# EAGLE schematic Gamma-TOP-Version2 (EAGLE 9.5.2)
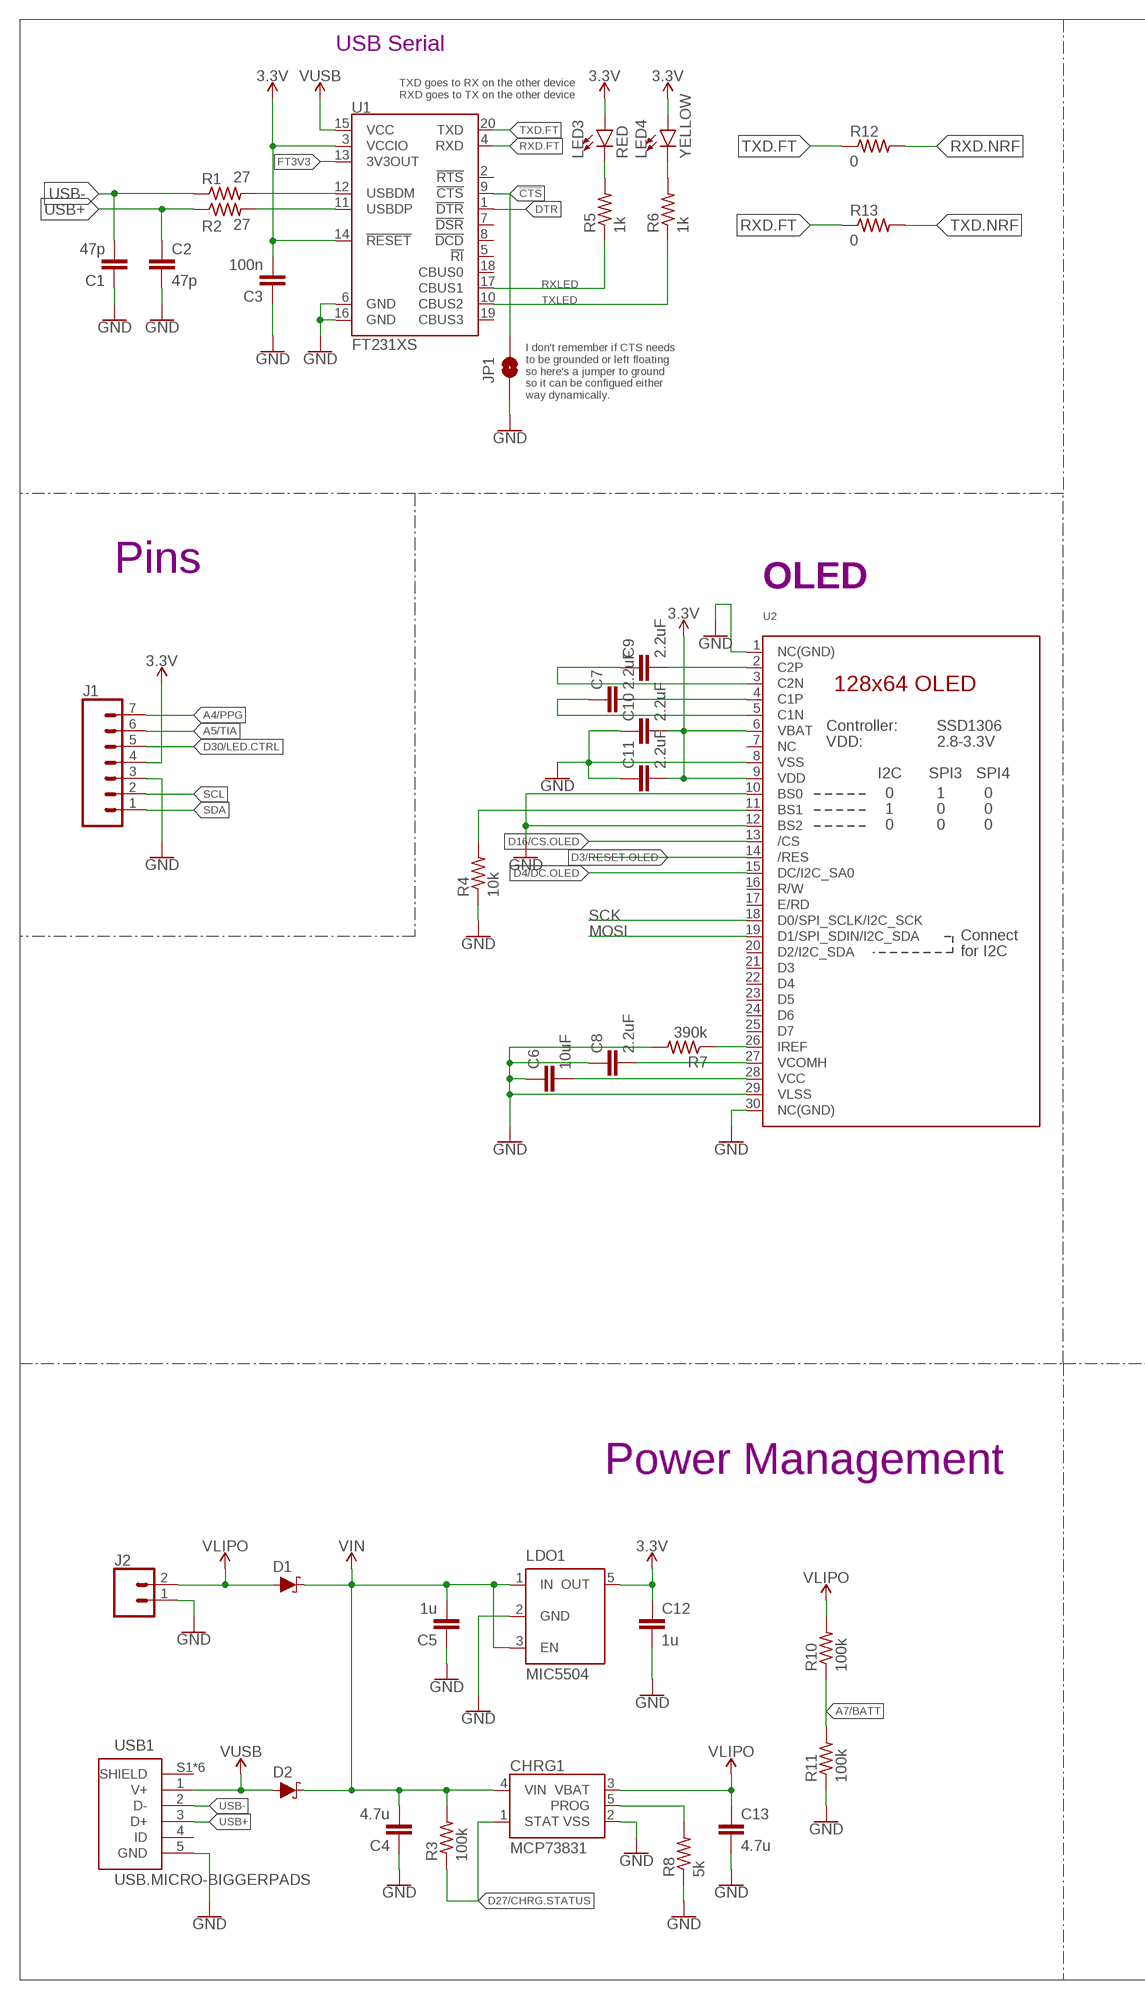
[diagram p0: schematic, sheet 1, part 1 of 2]
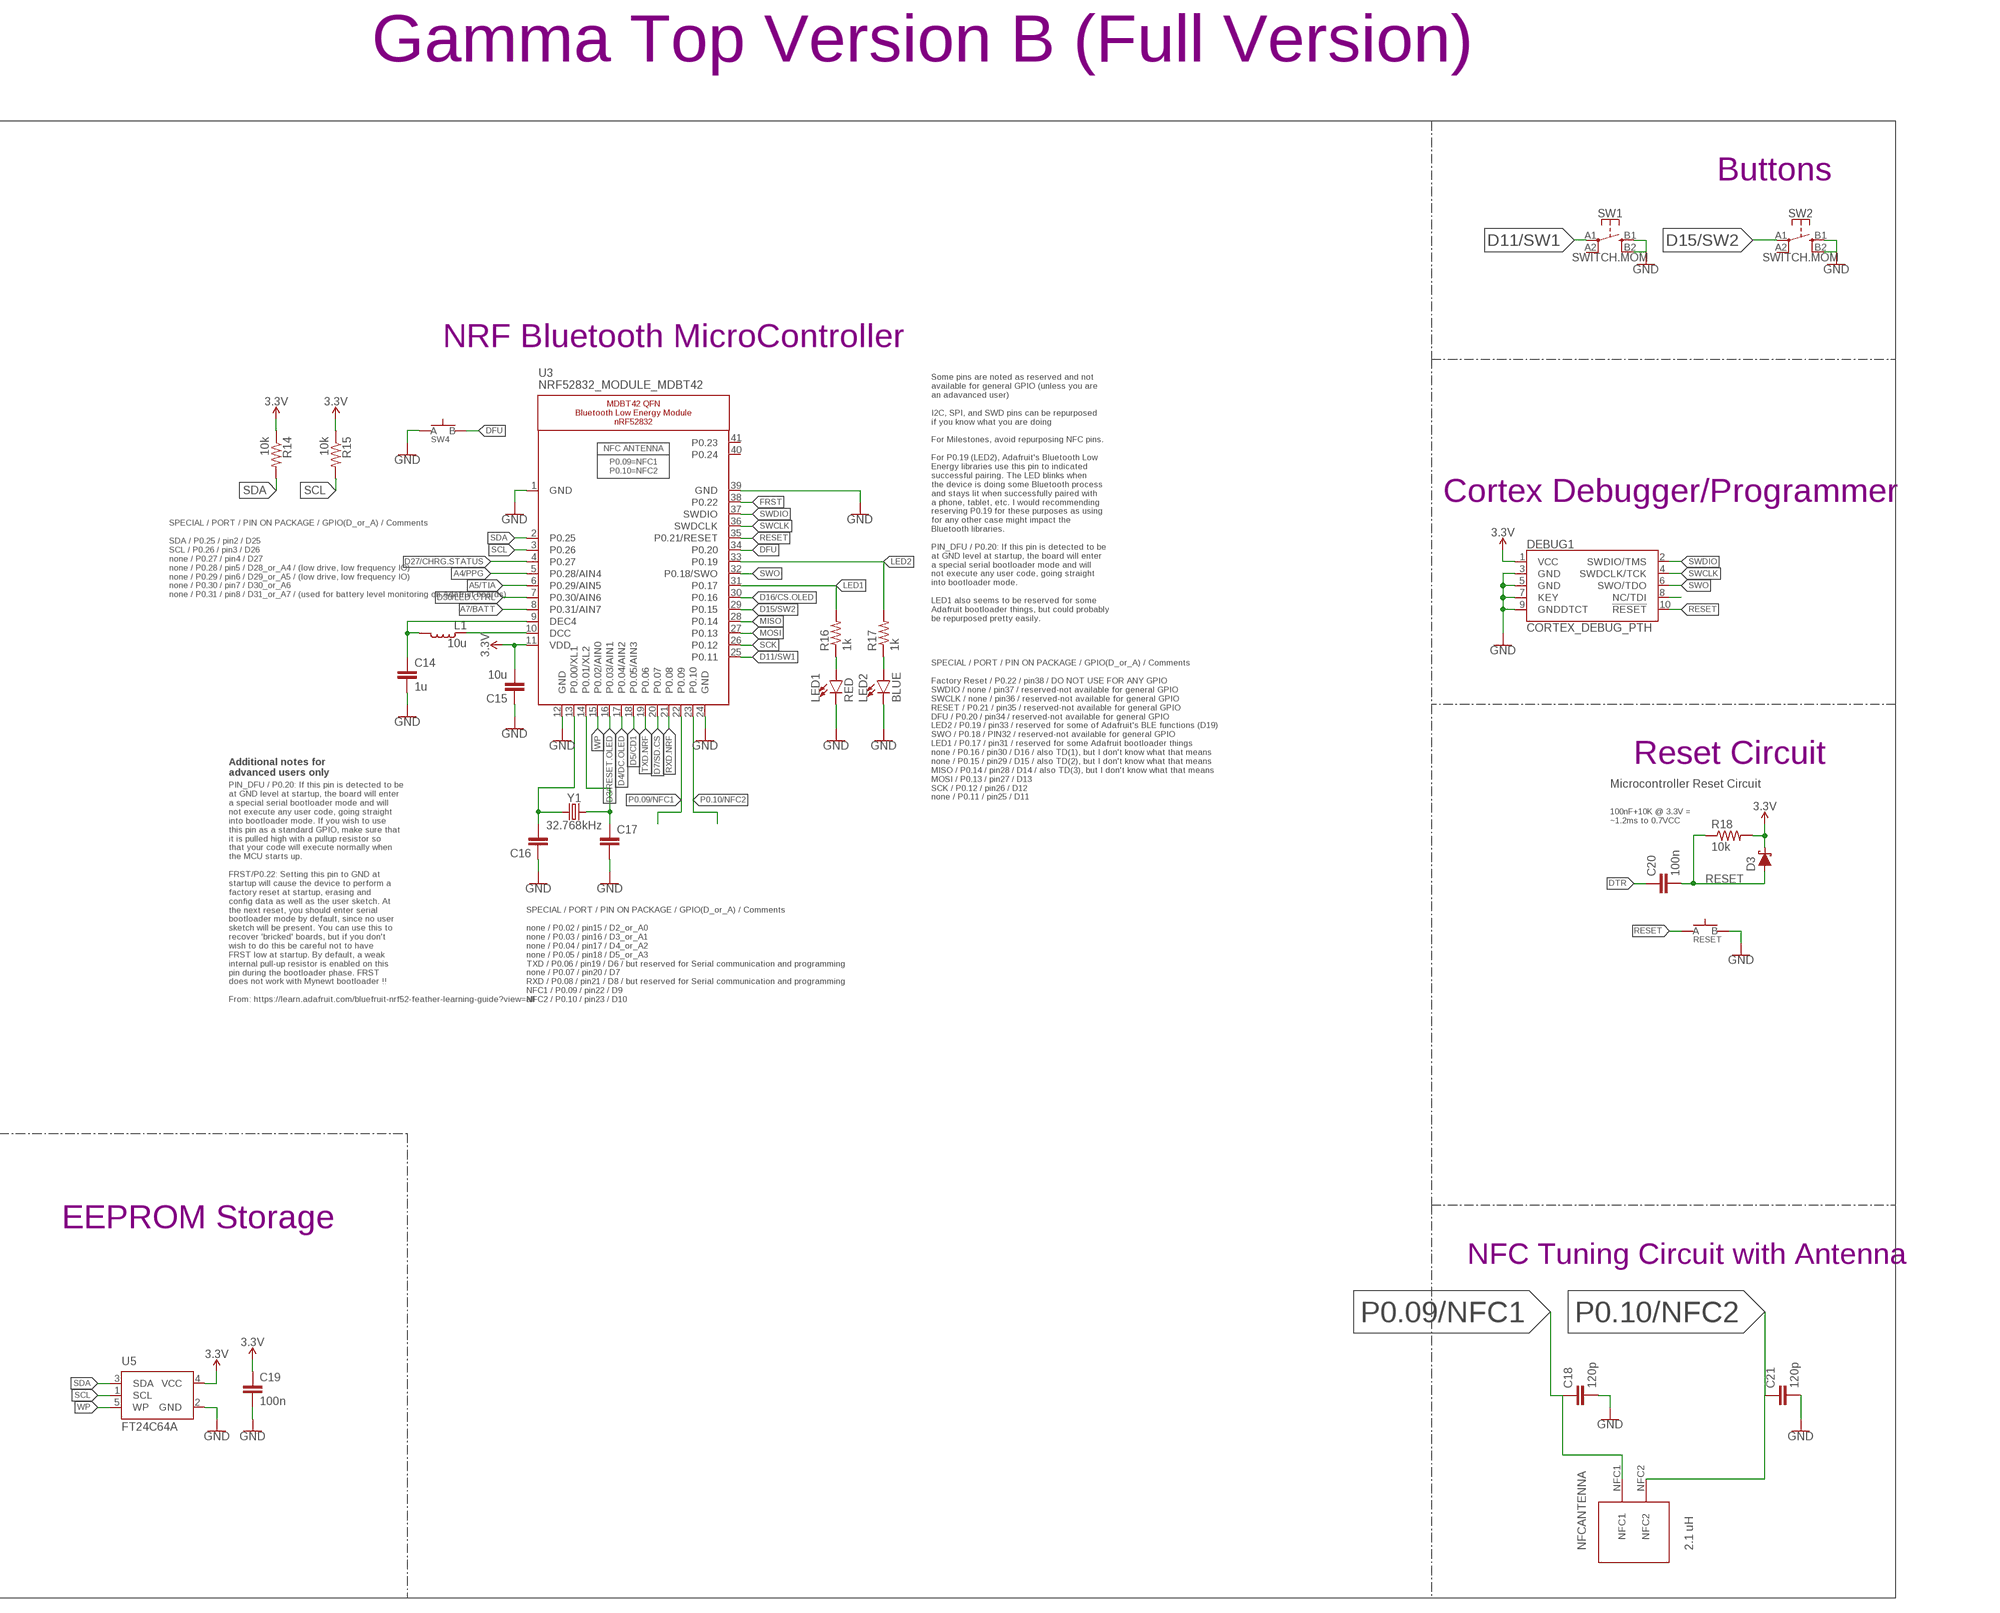
[diagram p1: schematic, sheet 1, part 2 of 2]

## Parts
C1  47p  CAPACITOR0603  [C0603]
C2  47p  CAPACITOR0603  [C0603]
C3  100n  CAPACITOR0603  [C0603]
C4  4.7u  CAPACITOR0603  [C0603]
C5  1u  CAPACITOR0603  [C0603]
C6  10uF  CAPACITOR0603  [C0603]
C7  2.2uF  CAPACITOR0402  [C0402]
C8  2.2uF  CAPACITOR0603  [C0603]
C9  2.2uF  CAPACITOR0402  [C0402]
C10  2.2uF  CAPACITOR0402  [C0402]
C11  2.2uF  CAPACITOR0402  [C0402]
C12  1u  CAPACITOR0603  [C0603]
C13  4.7u  CAPACITOR0603  [C0603]
C14  1u  CAPACITOR0603  [C0603]
C15  10u  CAPACITOR0805  [C0805]
C16  CAPACITOR0603  [C0603]
C17  CAPACITOR0603  [C0603]
C18  120p  CAPACITOR0603  [C0603]
C19  100n  CAPACITOR0603  [C0603]
C20  100n  CAPACITOR0603  [C0603]
C21  120p  CAPACITOR0603  [C0603]
CHRG1  MCP73831  [SOT23-5]
D1  SCHOTTKY-USC  [USC]
D2  SCHOTTKY-USC  [USC]
D3  SCHOTTKY-USC  [USC]
DEBUG1  CORTEX_DEBUG_PTH  [2X5-PTH-1.27MM]
J1  CONN_07-1.27MM  [1X07_1.27MM]
J2  CONN_02  [1X02]
JP1  JUMPER-SMT_2_NO_SILK  [SMT-JUMPER_2_NO_SILK]
L1  10u  INDUCTOR0603  [L0603]
LDO1  MIC5504  [SOT23-5]
LED1  RED  LED0603  [LED-0603]
LED2  BLUE  LED0603  [LED-0603]
LED3  RED  LED0603  [LED-0603]
LED4  YELLOW  LED0603  [LED-0603]
NFCANTENNA  2.1 uH  MOLEX-1462360151-ANTENNA  [1462360151]
R1  27  RESISTOR0603  [R0603]
R2  27  RESISTOR0603  [R0603]
R3  100k  RESISTOR0603  [R0603]
R4  10k  RESISTOR0603  [R0603]
R5  1k  RESISTOR0603  [R0603]
R6  1k  RESISTOR0603  [R0603]
R7  390k  RESISTOR0603  [R0603]
R8  5k  RESISTOR0603  [R0603]
R10  100k  RESISTOR0603  [R0603]
R11  100k  RESISTOR0603  [R0603]
R12  0  RESISTOR0603  [R0603]
R13  0  RESISTOR0603  [R0603]
R14  10k  RESISTOR0603  [R0603]
R15  10k  RESISTOR0603  [R0603]
R16  1k  RESISTOR0603  [R0603]
R17  1k  RESISTOR0603  [R0603]
R18  10k  RESISTOR0603  [R0603]
RESET  SPST-PTS830GG140-COPY.1-3  [BUTTON-GULLWING]
SW1  SWITCH.MOM  [TACTILE_SWITCH_SMD_6.2MM_TALL]
SW2  SWITCH.MOM  [TACTILE_SWITCH_SMD_6.2MM_TALL]
SW4  SPST-PTS830GG140-COPY.1-3  [BUTTON-GULLWING]
U1  FT231XS  [SSOP20_L]
U2  DISP_OLED_UG-2864HSWEG01-NO-WRAPAROUND  [UG-2864HSWEG01_0.96IN_NO-WRAPAROUND]
U3  NRF52832_MODULE_MDBT42  [BLE_MODULE_RAYTAC_MDBT42]
U5  FT24C64A  [SOT23-5]
USB1  USB.MICRO-BIGGERPADS  [USB-MICRO-01.BIGGERPADS]
Y1  32.768kHz  CRYSTALECS-.327-12.5-12-C-TR  [2-SMD.NOLEAD.2.0MMTO1.2MM]

## Nets
3.3V: C3.2 C10.2 C11.2 C12.1 C15.2 C19.1 D3.-(C) DEBUG1.1(VCC) J1.4 LDO1.5(OUT) LED3.A LED4.A R14.1 R15.1 R18.2 U1.3(VCCIO) U1.14(!RESET) U2.6(VBAT) U2.9(VDD) U3.11(VDD) U5.4(VCC)
!CTS: JP1.2 U1.9(!CTS)
A4/PPG: J1.7 U3.5(P0.28/AIN4)
A5/TIA: J1.6 U3.6(P0.29/AIN5)
A7/BATT: R10.1 R11.2 U3.8(P0.31/AIN7)
D3/RESET.OLED: U2.14(/RES) U3.16(P0.03/AIN1)
D4/DC.OLED: U2.15(DC/I2C_SA0) U3.17(P0.04/AIN2)
D5/CD1: U3.18(P0.05/AIN3)
D7/SD.CS: U3.20(P0.07)
D11/SW1: SW1.A1 U3.25(P0.11)
D15/SW2: SW2.A1 U3.29(P0.15)
D16/CS.OLED: U2.13(/CS) U3.30(P0.16)
D27/CHRG.STATUS: CHRG1.1(STAT) R3.1 U3.4(P0.27)
D30/LED.CTRL: J1.5 U3.7(P0.30/AIN6)
DFU: SW4.3(B) U3.34(P0.20)
DTR: C20.1 U1.1(!DTR)
FRST: U3.38(P0.22)
FT3V3: U1.13(3V3OUT)
GND: C1.1 C2.2 C3.1 C4.1 C5.1 C6.1 C8.1 C10.1 C11.1 C12.2 C13.2 C14.2 C15.1 C16.1 C17.2 C18.2 C19.2 C21.2 CHRG1.2(VSS) DEBUG1.3(GND) DEBUG1.5(GND) DEBUG1.7(KEY) DEBUG1.9(GNDDTCT) J1.3 J2.1 JP1.1 LDO1.2(GND) LED1.C LED2.C R4.1 R7.2 R8.1 R11.1 RESET.3(B) SW1.B1 SW1.B2 SW2.B1 SW2.B2 SW4.1(A) U1.6(GND) U1.16(GND) U2.1(NC(GND)) U2.8(VSS) U2.10(BS0) U2.12(BS2) U2.29(VLSS) U2.30(NC(GND)) U3.1(GND) U3.12(GND) U3.24(GND) U3.39(GND) U5.2(GND) USB1.5(GND)
LED1: R16.2 U3.31(P0.17)
LED2: R17.2 U3.33(P0.19)
MISO: U3.28(P0.14)
MOSI: U2.19(D1/SPI_SDIN/I2C_SDA) U3.27(P0.13)
N$1: R4.2 U2.11(BS1)
N$2: R7.1 U2.26(IREF)
N$3: C9.2 U2.2(C2P)
N$4: C16.2 U3.13(P0.00/XL1) Y1.P$1
N$5: C9.1 U2.3(C2N)
N$6: C17.1 U3.14(P0.01/XL2) Y1.P$2
N$7: C7.2 U2.4(C1P)
N$8: C7.1 U2.5(C1N)
N$9: LED1.A R16.1
N$10: LED2.A R17.1
N$11: L1.1 U3.10(DCC)
N$12: C14.1 L1.2 U3.9(DEC4)
N$13: C6.2 U2.28(VCC)
N$14: DEBUG1.8(NC/TDI)
N$15: C8.2 U2.27(VCOMH)
N$17: CHRG1.5(PROG) R8.2
N$23: R1.2 U1.12(USBDM)
N$24: R2.2 U1.11(USBDP)
N$25: LED3.C R5.2
N$26: LED4.C R6.2
P0.09/NFC1: C18.1 NFCANTENNA.NFC1 U3.22(P0.09)
P0.10/NFC2: C21.1 NFCANTENNA.NFC2 U3.23(P0.10)
RESET: C20.2 D3.+(A) DEBUG1.10(!RESET) R18.1 RESET.1(A) U3.35(P0.21/RESET)
RXD.FT: R13.1 U1.4(RXD)
RXD.NRF: R12.2 U3.21(P0.08)
RXLED: R5.1 U1.17(CBUS1)
SCK: U2.18(D0/SPI_SCLK/I2C_SCK) U3.26(P0.12)
SCL: J1.2 R15.2 U3.3(P0.26) U5.1(SCL)
SDA: J1.1 R14.2 U3.2(P0.25) U5.3(SDA)
SWCLK: DEBUG1.4(SWDCLK/TCK) U3.36(SWDCLK)
SWDIO: DEBUG1.2(SWDIO/TMS) U3.37(SWDIO)
SWO: DEBUG1.6(SWO/TDO) U3.32(P0.18/SWO)
TXD.FT: R12.1 U1.20(TXD)
TXD.NRF: R13.2 U3.19(P0.06)
TXLED: R6.1 U1.10(CBUS2)
USB+: C2.1 R2.1 USB1.3(D+)
USB-: C1.2 R1.1 USB1.2(D-)
V_USB: D2.+(A) U1.15(VCC) USB1.1(V+) ; supply symbol labelled VUSB
VIN: C4.2 C5.2 CHRG1.4(VIN) D1.-(C) D2.-(C) LDO1.1(IN) LDO1.3(EN) R3.2
VLIPO: C13.1 CHRG1.3(VBAT) D1.+(A) J2.2 R10.2
WP: U3.15(P0.02/AIN0) U5.5(WP)
Unconnected: SW1.A2 SW2.A2 U1.2(!RTS) U1.5(!RI) U1.7(!DSR) U1.8(!DCD) U1.18(CBUS0) U1.19(CBUS3) U2.7(NC) U2.16(R/W) U2.17(E/RD) U2.20(D2/I2C_SDA) U2.21(D3) U2.22(D4) U2.23(D5) U2.24(D6) U2.25(D7) U3.40(P0.24) U3.41(P0.23) USB1.4(ID) USB1.S1(SHIELD) USB1.S2(SHIELD) USB1.S3(SHIELD) USB1.S4(SHIELD) USB1.S5(SHIELD) USB1.S6(SHIELD)

## Notes on the sheet
- Gamma Top Version B (Full Version)
- USB Serial
- TXD goes to RX on the other device
  RXD goes to TX on the other device
- Buttons
- NRF Bluetooth MicroController
- I don't remember if CTS needs
  to be grounded or left floating
  so here's a jumper to ground
  so it can be configued either
  way dynamically.
- Cortex Debugger/Programmer
- Pins
- OLED
- SPECIAL / PORT / PIN ON PACKAGE / GPIO(D_or_A) / Comments
  
  SDA / P0.25 / pin2 / D25
  SCL / P0.26 / pin3 / D26
  none / P0.27 / pin4 / D27
  none / P0.28 / pin5 / D28_or_A4 / (low drive, low frequency IO)
  none / P0.29 / pin6 / D29_or_A5 / (low drive, low frequency IO)
  none / P0.30 / pin7 / D30_or_A6
  none / P0.31 / pin8 / D31_or_A7 / (used for battery level monitoring on Adafruit boards)
- Some pins are noted as reserved and not
  available for general GPIO (unless you are
  an adavanced user)
  
  I2C, SPI, and SWD pins can be repurposed
  if you know what you are doing
  
  For Milestones, avoid repurposing NFC pins.
  
  For P0.19 (LED2), Adafruit's Bluetooth Low
  Energy libraries use this pin to indicated
  successful pairing. The LED blinks when
  the device is doing some Bluetooth process
  and stays lit when successfully paired with
  a phone, tablet, etc. I would recommending
  reserving P0.19 for these purposes as using
  for any other case might impact the
  Bluetooth libraries.
  
  PIN_DFU / P0.20: If this pin is detected to be
  at GND level at startup, the board will enter
  a special serial bootloader mode and will
  not execute any user code, going straight
  into bootloader mode.
  
  LED1 also seems to be reserved for some
  Adafruit bootloader things, but could probably
  be repurposed pretty easily.
- Reset Circuit
- Additional notes for
  advanced users only
- Microcontroller Reset Circuit
- SPECIAL / PORT / PIN ON PACKAGE / GPIO(D_or_A) / Comments
  
  Factory Reset / P0.22 / pin38 / DO NOT USE FOR ANY GPIO
  SWDIO / none / pin37 / reserved-not available for general GPIO
  SWCLK / none / pin36 / reserved-not available for general GPIO
  RESET / P0.21 / pin35 / reserved-not available for general GPIO
  DFU / P0.20 / pin34 / reserved-not available for general GPIO
  LED2 / P0.19 / pin33 / reserved for some of Adafruit's BLE functions (D19)
  SWO / P0.18 / PIN32 / reserved-not available for general GPIO
  LED1 / P0.17 / pin31 / reserved for some Adafruit bootloader things
  none / P0.16 / pin30 / D16 / also TD(1), but I don't know what that means
  none / P0.15 / pin29 / D15 / also TD(2), but I don't know what that means
  MISO / P0.14 / pin28 / D14 / also TD(3), but I don't know what that means
  MOSI / P0.13 / pin27 / D13
  SCK / P0.12 / pin26 / D12
  none / P0.11 / pin25 / D11
- 100nF+10K @ 3.3V =
  ~1.2ms to 0.7VCC
- PIN_DFU / P0.20: If this pin is detected to be
  at GND level at startup, the board will enter
  a special serial bootloader mode and will
  not execute any user code, going straight
  into bootloader mode. If you wish to use
  this pin as a standard GPIO, make sure that
  it is pulled high with a pullup resistor so
  that your code will execute normally when
  the MCU starts up.
  
  FRST/P0.22: Setting this pin to GND at
  startup will cause the device to perform a
  factory reset at startup, erasing and
  config data as well as the user sketch. At
  the next reset, you should enter serial
  bootloader mode by default, since no user
  sketch will be present. You can use this to
  recover 'bricked' boards, but if you don't
  wish to do this be careful not to have
  FRST low at startup. By default, a weak
  internal pull-up resistor is enabled on this
  pin during the bootloader phase. FRST
  does not work with Mynewt bootloader !!
  
  From: https://learn.adafruit.com/bluefruit-nrf52-feather-learning-guide?view=all
- SPECIAL / PORT / PIN ON PACKAGE / GPIO(D_or_A) / Comments
  
  none / P0.02 / pin15 / D2_or_A0
  none / P0.03 / pin16 / D3_or_A1
  none / P0.04 / pin17 / D4_or_A2
  none / P0.05 / pin18 / D5_or_A3
  TXD / P0.06 / pin19 / D6 / but reserved for Serial communication and programming
  none / P0.07 / pin20 / D7
  RXD / P0.08 / pin21 / D8 / but reserved for Serial communication and programming
  NFC1 / P0.09 / pin22 / D9
  NFC2 / P0.10 / pin23 / D10
- Power Management
- EEPROM Storage
- NFC Tuning Circuit with Antenna

## Library data of the parts
C1-C21 = LinnesLab-Passives:CAPACITOR
CHRG1 = LinnesLab-Power:MCP73831: MCP73831T Li-Ion, Li-Pol Controller Miniature single cell, fully integrated Li-Ion, Li-polymer charge management controller Datasheet <http://ww1.microchip.com/downloads/en/DeviceDoc/20001984g.pdf> SparkFun Products: SparkFun ESP32 Thing <https://www.sparkfun.com/products/13907> SparkFun 9DoF Razor IMU M0 <https://www.sparkfun.com/products/14001>; PROD_ID: IC-09995
D1-D3 = LinnesLab-DiscreteSemi:SCHOTTKY: Schottky diode A Schottky diode is a semiconductor diode which has a low forward voltage drop and a very fast switching action. Example: Digi-Key Part Number: RB161MM-20CT-ND
DEBUG1 = LinnesLab-Connectors:CORTEX_DEBUG: Cortex Debug Connector - 10 pin Supports JTAG debug, Serial Wire debug, and Serial Wire Viewer. PTH and SMD connector options available. General Connector Information <http://infocenter.arm.com/help/topic/com.arm.doc.faqs/attached/13634/cortex_debug_connectors.pdf> Products: PTH Connector <http://www.digikey.com/product-detail/en/cnc-tech/3220-10-0100-00/1175-1627-ND/3883661> -via Digi-Key SparkFun PSoc <https://www.sparkfun.com/products/13229> SparkFun T <https://www.sparkfun.com/products/13810>
J1 = LinnesLab-Connectors:CONN_07: Multi connection point. Often used as Generic Header-pin footprint for 0.1 inch spaced/style header connections On any of the 0.1 inch spaced packages, you can populate with these: Break Away Headers - Straight <https://www.sparkfun.com/products/116> (PRT-00116) Break Away Male Headers - Right Angle <https://www.sparkfun.com/products/553> (PRT-00553) Female Headers <https://www.sparkfun.com/products/115> (PRT-00115) Break Away Headers - Machine Pin <https://www.sparkfun.com/products/117> (PRT-00117) Break Away Female Headers - Swiss Machine Pin <https://www.sparkfun.com/products/743> (PRT-00743) For SCREWTERMINALS and SPRING TERMINALS visit here: Screw Terimnals on SparkFun.com <https://www.sparkfun.com/search/results?term=Screw+Terminals> (5mm/3.5mm/2.54mm spacing) This device is also useful as a general connection point to wire up your design to another part of your project. Our various solder wires solder well into these plated through hole pads. Hook-Up Wire - Assortment (Stranded, 22 AWG) <https://www.sparkfun.com/products/11375> (PRT-11375) Hook-Up Wire - Assortment (Solid Core, 22 AWG) <https://www.sparkfun.com/products/11367> (PRT-11367) View the entire wire category on our website here <https://www.sparkfun.com/categories/141> Special notes: Molex polarized connector foot print use with SKU : PRT-08231 with associated crimp pins and housings. 1MM SMD Version SKU: PRT-10208 NOTES ON THE VARIANTS LOCK and LOCK_LONGPADS... This footprint was designed to help hold the alignment of a through-hole component (i.e. 6-pin header) while soldering it into place. You may notice that each hole has been shifted either up or down by 0.005 of an inch from it's more standard position (which is a perfectly straight line). This slight alteration caused the pins (the squares in the middle) to touch the edges of the holes. Because they are alternating, it causes a "brace" to hold the component in place. 0.005 has proven to be the perfect amount of "off-center" position when using our standard breakaway headers. Although looks a little odd when you look at the bare footprint, once you have a header in there, the alteration is very hard to notice. Also,if you push a header all the way into place, it is covered up entirely on the bottom side.
J2 = LinnesLab-Connectors:CONN_02: Multi connection point. Often used as Generic Header-pin footprint for 0.1 inch spaced/style header connections On any of the 0.1 inch spaced packages, you can populate with these: Break Away Headers - Straight <https://www.sparkfun.com/products/116> (PRT-00116) Break Away Male Headers - Right Angle <https://www.sparkfun.com/products/553> (PRT-00553) Female Headers <https://www.sparkfun.com/products/115> (PRT-00115) Break Away Headers - Machine Pin <https://www.sparkfun.com/products/117> (PRT-00117) Break Away Female Headers - Swiss Machine Pin <https://www.sparkfun.com/products/743> (PRT-00743) For SCREWTERMINALS and SPRING TERMINALS visit here: Screw Terimnals on SparkFun.com <https://www.sparkfun.com/search/results?term=Screw+Terminals> (5mm/3.5mm/2.54mm spacing) This device is also useful as a general connection point to wire up your design to another part of your project. Our various solder wires solder well into these plated through hole pads. Hook-Up Wire - Assortment (Stranded, 22 AWG) <https://www.sparkfun.com/products/11375> (PRT-11375) Hook-Up Wire - Assortment (Solid Core, 22 AWG) <https://www.sparkfun.com/products/11367> (PRT-11367) View the entire wire category on our website here <https://www.sparkfun.com/categories/141> Special notes: Molex polarized connector foot print use with: PRT-08233 with associated crimp pins and housings. 2.54_SCREWTERM for use with PRT-10571. 3.5mm Screw Terminal footprints for PRT-08084 5mm Screw Terminal footprints for use with PRT-08432
JP1 = LinnesLab-Switches:JUMPER-SMT_2_NO: Normally open jumper This jumper has two pads in close proximity to each other. Apply solder to close the connection. Round pads are easier to solder for beginners, but are a lot larger. SparkFun Product that uses the round pads: SparkFun EL Sequencer <https://www.sparkfun.com/products/12781>
L1 = LinnesLab-Passives:INDUCTOR
LDO1 = LinnesLab-Power:MIC5504: MIC5504 Voltage Regulator Output Voltages: 1.0V to 3.3V Input Voltages: 2.5V to 5.5V Link to Datasheet http://ww1.microchip.com/downloads/en/DeviceDoc/MIC550X.pdf
LED1-LED4 = LinnesLab-LED:LED: LED (Generic) Standard schematic elements and footprints for 5mm, 3mm, 1206, and 0603 sized LEDs. Generic LEDs with no color specified. LTST-C190KGKT: arrow indicates cathode
NFCANTENNA = NFC-Antenna:MOLEX-1462360151-ANTENNA: This is a 15mm x 15mm x 0.27mm antenna with a resonant frequency of 13.56 Mhz.
R1-R8 R10-R18 = LinnesLab-Passives:RESISTOR
RESET SW4 = LinnesLab-Switches:SPST-PTS830GG140-COPY
SW1 SW2 = LinnesLab-Switches:SWITCH.MOM: PTS645SM43SMTR92 LFS
U1 = LinnesLab-DigitalIC:FT231X: FTDI FT231X Full Speed USB to Full-handshake UART This USB2.0 Full Speed IC offers a compact bridge to full handshake UART interfaces. The device is a UART, capable of operating up to 3MBaud, with low power consumption (8mA). The FT231X includes the complete FT-X series feature set and enables USB to be added into a system design quickly and easily over a UART interface. Datasheet <http://cdn.sparkfun.com/datasheets/Components/General%20IC/DS_FT231X.pdf>; DIGIKEY: 768-1156-5-ND; MFN: FT231XS-U
U2 = LinnesLab-Displays:DISP_OLED_UG-2864HSWEG01: UG-2864HSWEG01 OLED display Both 1.3" and 0.96" models share the same FPC tab footprint, only the screen dimensions vary.
U3 = LinnesLab-Microcontrollers:NRF52832_MODULE_MDBT42: MDBT42 - BLE Module (nRF52832 QFN) VDD: 1.7-3.6V
U5 = LinnesLab-DigitalIC:FT24C64A: I2C EEPROM 64 kB Arduino Library https://github.com/LinnesLab/EEPROM_24C64A Digi-Key Part Number: 1219-1261-1-ND Manufacturer Part Number: FT24C64A-ELR-T; DIGIKEY: 1219-1261-1-ND; MFN: FT24C64A-ELR-T
USB1 = LinnesLab-Connectors:USB.MICRO: DigiKey PN: 609-4613-1-ND
Y1 = LinnesLab-Clocks:CRYSTAL; DIGIKEY: XC2288CT-ND; FREQ: 32.7680KHZ; LOAD_CAP: 12.5pF